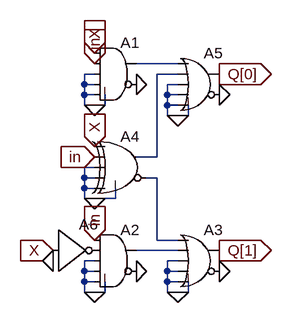
[diagram p0: schematic demux_1default-1bit-1to2.asc]
demux_1default-1bit-1to2.asc, the LTspice schematic file:
Version 4
SHEET 1 880 680
WIRE -48 -224 -112 -224
WIRE -176 -208 -192 -208
WIRE -48 -208 -80 -208
WIRE -192 -192 -192 -208
WIRE -176 -192 -192 -192
WIRE -48 -192 -64 -192
WIRE -192 -176 -192 -192
WIRE -176 -176 -192 -176
WIRE -64 -176 -64 -192
WIRE -48 -176 -64 -176
WIRE -192 -160 -192 -176
WIRE -176 -160 -192 -160
WIRE -160 -160 -160 -176
WIRE -160 -160 -176 -160
WIRE -64 -160 -64 -176
WIRE -48 -160 -64 -160
WIRE -64 -144 -64 -160
WIRE -48 -144 -64 -144
WIRE -32 -144 -32 -160
WIRE -32 -144 -48 -144
WIRE -80 -80 -80 -208
WIRE -80 -80 -112 -80
WIRE -176 -64 -192 -64
WIRE -192 -48 -192 -64
WIRE -176 -48 -192 -48
WIRE -80 -48 -96 -48
WIRE -192 -32 -192 -48
WIRE -176 -32 -192 -32
WIRE -192 -16 -192 -32
WIRE -176 -16 -192 -16
WIRE -144 -16 -144 -32
WIRE -144 -16 -176 -16
WIRE -80 48 -80 -48
WIRE -48 48 -80 48
WIRE -48 64 -112 64
WIRE -176 80 -192 80
WIRE -48 80 -64 80
WIRE -192 96 -192 80
WIRE -176 96 -192 96
WIRE -64 96 -64 80
WIRE -48 96 -64 96
WIRE -192 112 -192 96
WIRE -176 112 -192 112
WIRE -64 112 -64 96
WIRE -48 112 -64 112
WIRE -192 128 -192 112
WIRE -176 128 -192 128
WIRE -160 128 -160 112
WIRE -160 128 -176 128
WIRE -64 128 -64 112
WIRE -48 128 -64 128
WIRE -32 128 -32 112
WIRE -32 128 -48 128
FLAG -176 -160 0
FLAG -112 -192 0
FLAG -176 -80 in
IOPIN -176 -80 In
FLAG 16 -208 Q[0]
IOPIN 16 -208 Out
FLAG -176 -96 X
IOPIN -176 -96 In
FLAG -176 -16 0
FLAG -176 -224 in
IOPIN -176 -224 In
FLAG -176 -240 X
IOPIN -176 -240 In
FLAG -48 -144 0
FLAG 16 -176 0
FLAG 16 64 Q[1]
IOPIN 16 64 Out
FLAG -48 128 0
FLAG 16 96 0
FLAG -176 128 0
FLAG -112 96 0
FLAG -176 48 in
IOPIN -176 48 In
FLAG -240 64 X
IOPIN -240 64 In
FLAG -240 80 0
SYMBOL Digital\\and -144 -272 R0
SYMATTR InstName A1
SYMBOL Digital\\xor -128 -128 R0
SYMATTR InstName A4
SYMBOL Digital\\or -16 -256 R0
SYMATTR InstName A5
SYMBOL Digital\\or -16 16 R0
SYMATTR InstName A3
SYMBOL Digital\\and -144 16 R0
SYMATTR InstName A2
SYMBOL Digital\\inv -240 0 R0
SYMATTR InstName A6

The netlist it stands for:
* demux_1default-1bit-1to2.asc
A1 X in 0 0 0 0 N001 0 AND
A4 X in 0 0 0 N003 N002 0 XOR
A5 N001 N002 0 0 0 0 Q[0] 0 OR
A3 N003 N004 0 0 0 0 Q[1] 0 OR
A2 in P001 0 0 0 0 N004 0 AND
A6 X 0 0 0 0 P001 0 0 BUF
.backanno
.end